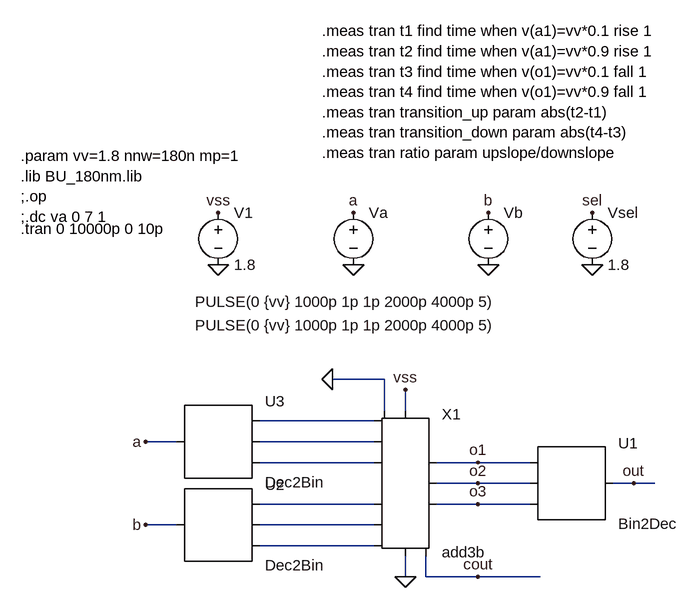
[diagram p0: schematic add3b_test.asc]
add3b_test.asc, the LTspice schematic file:
Version 4
SHEET 1 1092 680
WIRE 400 160 320 160
WIRE 400 208 400 160
WIRE 432 208 432 176
WIRE 384 224 208 224
WIRE 80 256 32 256
WIRE 384 256 208 256
WIRE 384 288 208 288
WIRE 544 288 480 288
WIRE 624 288 544 288
WIRE 544 320 480 320
WIRE 624 320 544 320
WIRE 784 320 752 320
WIRE 816 320 784 320
WIRE 384 352 208 352
WIRE 544 352 480 352
WIRE 624 352 544 352
WIRE 80 384 32 384
WIRE 384 384 208 384
WIRE 384 416 208 416
WIRE 432 464 432 432
WIRE 464 464 464 432
WIRE 544 464 464 464
WIRE 640 464 544 464
FLAG 784 320 out
FLAG 432 176 vss
FLAG 432 464 0
FLAG 144 -16 0
FLAG 352 -16 0
FLAG 560 -16 0
FLAG 144 -96 vss
FLAG 352 -96 a
FLAG 560 -96 b
FLAG 32 256 a
FLAG 32 384 b
FLAG 720 -16 0
FLAG 720 -96 sel
FLAG 320 160 0
FLAG 544 352 o3
FLAG 544 320 o2
FLAG 544 288 o1
FLAG 544 464 cout
SYMBOL Bin2Dec 688 320 R0
SYMATTR InstName U1
SYMATTR SpiceLine Vhigh={vv}
SYMBOL Dec2Bin 144 384 R0
SYMATTR InstName U2
SYMATTR SpiceLine Vhigh={vv}
SYMBOL Dec2Bin 144 256 R0
SYMATTR InstName U3
SYMATTR SpiceLine Vhigh={vv}
SYMBOL /voltage 144 -112 R0
SYMATTR InstName V1
SYMATTR Value 1.8
SYMBOL /voltage 352 -112 R0
WINDOW 3 -244 153 Left 2
SYMATTR InstName Va
SYMATTR Value PULSE(0 {vv} 1000p 1p 1p 2000p 4000p 5)
SYMBOL /voltage 560 -112 R0
WINDOW 3 -452 189 Left 2
SYMATTR InstName Vb
SYMATTR Value PULSE(0 {vv} 1000p 1p 1p 2000p 4000p 5)
SYMBOL /voltage 720 -112 R0
SYMATTR InstName Vsel
SYMATTR Value 1.8
SYMBOL add3b 432 320 R0
SYMATTR InstName X1
TEXT -160 -184 Left 2 !.param vv=1.8 nnw=180n mp=1\n.lib BU_180nm.lib\n;.op\n;.dc va 0 7 1
TEXT -160 -72 Left 2 !.tran 0 10000p 0 10p
TEXT 304 -376 Left 2 !.meas tran t1 find time when v(a1)=vv*0.1 rise 1\n.meas tran t2 find time when v(a1)=vv*0.9 rise 1\n.meas tran t3 find time when v(o1)=vv*0.1 fall 1\n.meas tran t4 find time when v(o1)=vv*0.9 fall 1\n.meas tran transition_up param abs(t2-t1)\n.meas tran transition_down param abs(t4-t3)\n.meas tran ratio param upslope/downslope

The netlist it stands for:
* add3b_test.asc
XU1 o1 o2 o3 out Bin2Dec Vhigh={vv}
XU2 b N004 N005 N006 Dec2Bin Vhigh={vv}
XU3 a N001 N002 N003 Dec2Bin Vhigh={vv}
V1 vss 0 1.8
Va a 0 PULSE(0 {vv} 1000p 1p 1p 2000p 4000p 5)
Vb b 0 PULSE(0 {vv} 1000p 1p 1p 2000p 4000p 5)
Vsel sel 0 1.8
XX1 vss N001 N002 N003 N004 N005 N006 0 o1 o2 o3 cout 0 add3b
.param vv=1.8 nnw=180n mp=1
.lib BU_180nm.lib
;.op
;.dc va 0 7 1
.tran 0 10000p 0 10p
.meas tran t1 find time when v(a1)=vv*0.1 rise 1
.meas tran t2 find time when v(a1)=vv*0.9 rise 1
.meas tran t3 find time when v(o1)=vv*0.1 fall 1
.meas tran t4 find time when v(o1)=vv*0.9 fall 1
.meas tran transition_up param abs(t2-t1)
.meas tran transition_down param abs(t4-t3)
.meas tran ratio param upslope/downslope
.lib BIN2DEC.sub
.lib DEC2BIN.sub
.backanno
.end

* Results of the author's LTspice run, read from the files saved beside the schematic
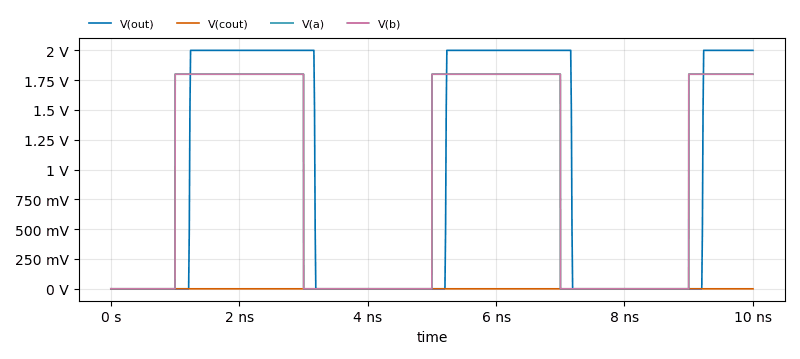
[diagram p1: Transient Analysis of add3b_test.asc, plotted from the saved traces]
* Transient Analysis, 1 run:
*   V(out): min 0 V, max 2 V, average 938.1 mV, rms 1.367 V, last 2 V
*   V(cout): min 2.851 µV, max 14.29 µV, average 7.971 µV, rms 8.002 µV, last 7.97 µV
*   V(a): min 0 V, max 1.8 V, average 900.3 mV, rms 1.273 V, last 1.8 V
*   V(b): min 0 V, max 1.8 V, average 900.3 mV, rms 1.273 V, last 1.8 V
* From the log:
*   Measurement "t1" FAIL'ed
*   Measurement "t2" FAIL'ed
*   Measurement "t3" FAIL'ed
*   Measurement "t4" FAIL'ed
*   Measurement "transition_up" FAIL'ed
*   Measurement "transition_down" FAIL'ed
*   Measurement "ratio" FAIL'ed